# EAGLE schematic beagl (EAGLE 6.2)
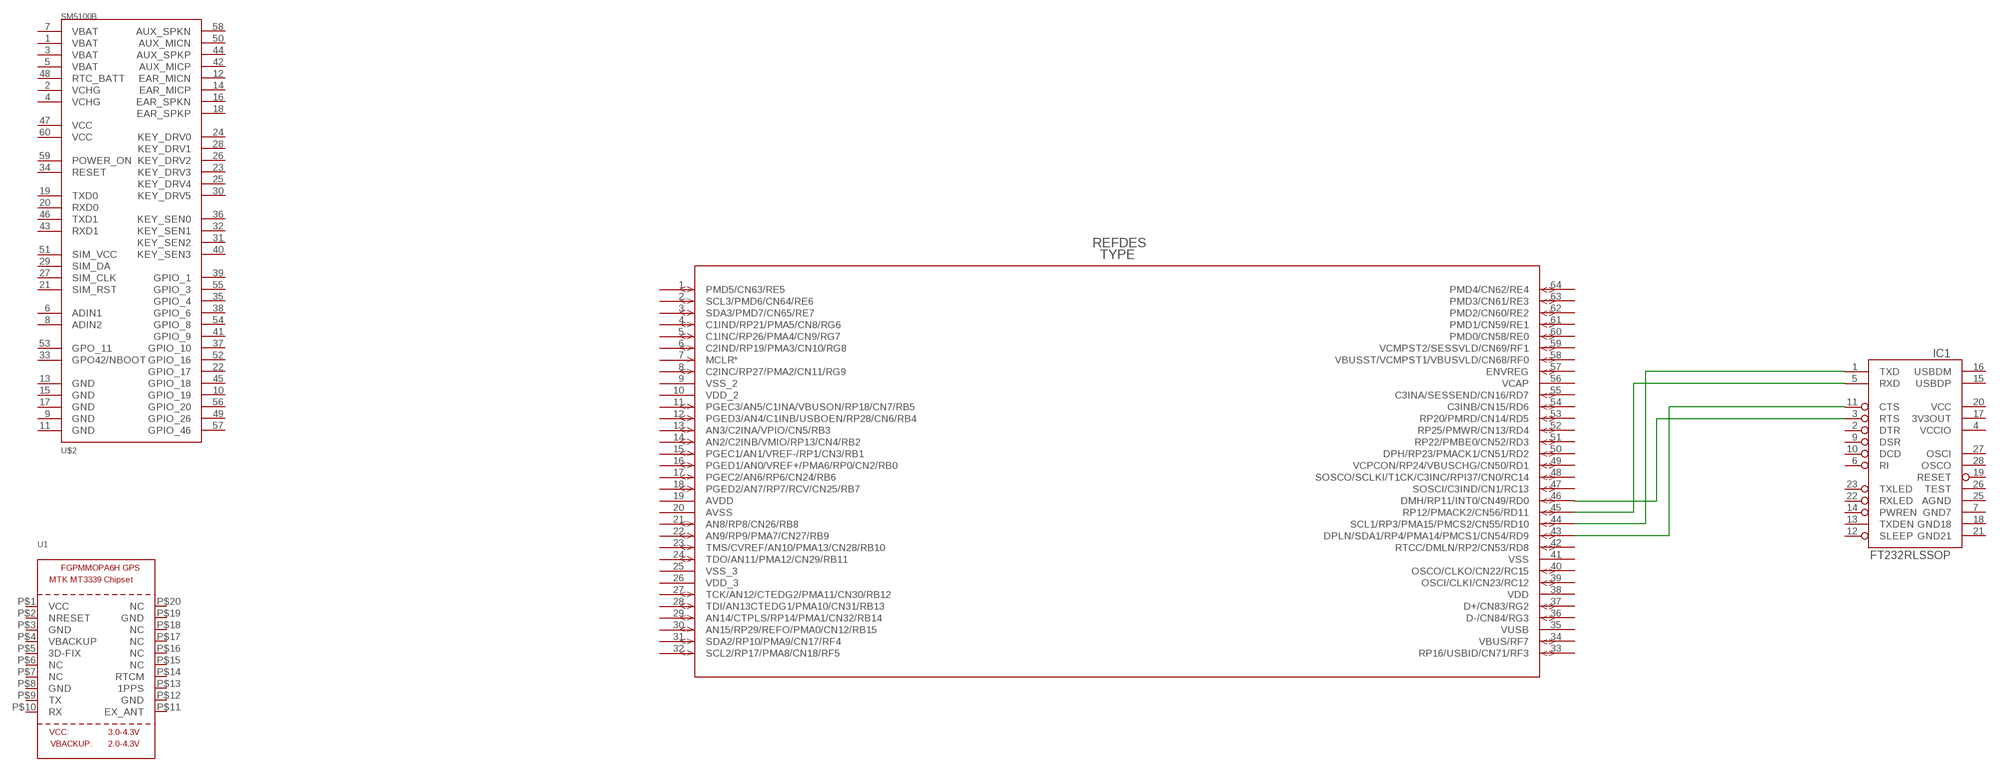
[diagram p0: schematic, sheet 1]

## Parts
IC1  FT232RLSSOP  [SSOP28DB]
U1  GPS_FGPMMOPA6H  [FGPMMOPA6H]
U$1  PIC24FJ256GB206-  [TQFP64_10X10MC]
U$2  SM5100B  [SM5100B]

## Nets
N$1: IC1.1(TXD) U$1.44(SCL1/RP3/PMA15/PMCS2/CN55/RD10)
N$2: IC1.5(RXD) U$1.45(RP12/PMACK2/CN56/RD11)
N$3: IC1.3(RTS) U$1.46(DMH/RP11/INT0/CN49/RD0)
N$4: IC1.11(CTS) U$1.43(DPLN/SDA1/RP4/PMA14/PMCS1/CN54/RD9)
Unconnected: IC1.2(DTR) IC1.6(RI) IC1.9(DSR) IC1.10(DCD) IC1.12(SLEEP) IC1.13(TXDEN) IC1.14(PWREN) IC1.15(USBDP) IC1.16(USBDM) IC1.17(3V3OUT) IC1.19(RESET) IC1.22(RXLED) IC1.23(TXLED) IC1.26(TEST) IC1.27(OSCI) IC1.28(OSCO) U1.P$1(VCC) U1.P$2(NRESET) U1.P$3(GND) U1.P$4(VBACKUP) U1.P$5(3D-FIX) U1.P$6(NC) U1.P$7(NC) U1.P$8(GND) U1.P$9(TX) U1.P$10(RX) U1.P$11(EX_ANT) U1.P$12(GND) U1.P$13(1PPS) U1.P$14(RTCM) U1.P$15(NC) U1.P$16(NC) U1.P$17(NC) U1.P$18(NC) U1.P$19(GND) U1.P$20(NC) U$1.1(PMD5/CN63/RE5) U$1.2(SCL3/PMD6/CN64/RE6) U$1.3(SDA3/PMD7/CN65/RE7) U$1.4(C1IND/RP21/PMA5/CN8/RG6) U$1.5(C1INC/RP26/PMA4/CN9/RG7) U$1.6(C2IND/RP19/PMA3/CN10/RG8) U$1.7(MCLR*) U$1.8(C2INC/RP27/PMA2/CN11/RG9) U$1.9(VSS_2) U$1.10(VDD_2) U$1.11(PGEC3/AN5/C1INA/VBUSON/RP18/CN7/RB5) U$1.12(PGED3/AN4/C1INB/USBOEN/RP28/CN6/RB4) U$1.13(AN3/C2INA/VPIO/CN5/RB3) U$1.14(AN2/C2INB/VMIO/RP13/CN4/RB2) U$1.15(PGEC1/AN1/VREF-/RP1/CN3/RB1) U$1.16(PGED1/AN0/VREF+/PMA6/RP0/CN2/RB0) U$1.17(PGEC2/AN6/RP6/CN24/RB6) U$1.18(PGED2/AN7/RP7/RCV/CN25/RB7) U$1.19(AVDD) U$1.20(AVSS) U$1.21(AN8/RP8/CN26/RB8) U$1.22(AN9/RP9/PMA7/CN27/RB9) U$1.23(TMS/CVREF/AN10/PMA13/CN28/RB10) U$1.24(TDO/AN11/PMA12/CN29/RB11) U$1.25(VSS_3) U$1.26(VDD_3) U$1.27(TCK/AN12/CTEDG2/PMA11/CN30/RB12) U$1.28(TDI/AN13CTEDG1/PMA10/CN31/RB13) U$1.29(AN14/CTPLS/RP14/PMA1/CN32/RB14) U$1.30(AN15/RP29/REFO/PMA0/CN12/RB15) U$1.31(SDA2/RP10/PMA9/CN17/RF4) U$1.32(SCL2/RP17/PMA8/CN18/RF5) U$1.33(RP16/USBID/CN71/RF3) U$1.34(VBUS/RF7) U$1.35(VUSB) U$1.36(D-/CN84/RG3) U$1.37(D+/CN83/RG2) U$1.38(VDD) U$1.39(OSCI/CLKI/CN23/RC12) U$1.40(OSCO/CLKO/CN22/RC15) U$1.41(VSS) U$1.42(RTCC/DMLN/RP2/CN53/RD8) U$1.47(SOSCI/C3IND/CN1/RC13) U$1.48(SOSCO/SCLKI/T1CK/C3INC/RPI37/CN0/RC14) U$1.49(VCPCON/RP24/VBUSCHG/CN50/RD1) U$1.50(DPH/RP23/PMACK1/CN51/RD2) U$1.51(RP22/PMBE0/CN52/RD3) U$1.52(RP25/PMWR/CN13/RD4) U$1.53(RP20/PMRD/CN14/RD5) U$1.54(C3INB/CN15/RD6) U$1.55(C3INA/SESSEND/CN16/RD7) U$1.56(VCAP) U$1.57(ENVREG) U$1.58(VBUSST/VCMPST1/VBUSVLD/CN68/RF0) U$1.59(VCMPST2/SESSVLD/CN69/RF1) U$1.60(PMD0/CN58/RE0) U$1.61(PMD1/CN59/RE1) U$1.62(PMD2/CN60/RE2) U$1.63(PMD3/CN61/RE3) U$1.64(PMD4/CN62/RE4) U$2.1(VBAT) U$2.2(VCHG) U$2.3(VBAT) U$2.4(VCHG) U$2.5(VBAT) U$2.6(ADIN1) U$2.7(VBAT) U$2.8(ADIN2) U$2.9(GND) U$2.10(GPIO_19) U$2.11(GND) U$2.12(EAR_MICN) U$2.13(GND) U$2.14(EAR_MICP) U$2.15(GND) U$2.16(EAR_SPKN) U$2.17(GND) U$2.18(EAR_SPKP) U$2.19(TXD0) U$2.20(RXD0) U$2.21(SIM_RST) U$2.22(GPIO_17) U$2.23(KEY_DRV3) U$2.24(KEY_DRV0) U$2.25(KEY_DRV4) U$2.26(KEY_DRV2) U$2.27(SIM_CLK) U$2.28(KEY_DRV1) U$2.29(SIM_DA) U$2.30(KEY_DRV5) U$2.31(KEY_SEN2) U$2.32(KEY_SEN1) U$2.33(GPO42/NBOOT) U$2.34(RESET) U$2.35(GPIO_4) U$2.36(KEY_SEN0) U$2.37(GPIO_10) U$2.38(GPIO_6) U$2.39(GPIO_1) U$2.40(KEY_SEN3) U$2.41(GPIO_9) U$2.42(AUX_MICP) U$2.43(RXD1) U$2.44(AUX_SPKP) U$2.45(GPIO_18) U$2.46(TXD1) U$2.47(VCC) U$2.48(RTC_BATT) U$2.49(GPIO_26) U$2.50(AUX_MICN) U$2.51(SIM_VCC) U$2.52(GPIO_16) U$2.53(GPO_11) U$2.54(GPIO_8) U$2.55(GPIO_3) U$2.56(GPIO_20) U$2.57(GPIO_46) U$2.58(AUX_SPKN) U$2.59(POWER_ON) U$2.60(VCC)

## Power pins joined to a net without a drawn wire
AGND: IC1.25(AGND)
GND7: IC1.7(GND7)
GND18: IC1.18(GND18)
GND21: IC1.21(GND21)
VCC: IC1.20(VCC)
VCCIO: IC1.4(VCCIO)

## Library data of the parts
IC1 = SparkFun:FT232RL: USB UART FT232RL 4th Generation USB UART (USB <-> Serial) Controller. Spark Fun Electronics SKU : COM-00650
U1 = adafruit:GPS_FGPMMOPA6H: GPS Module - MTK MT3339 Chipset, -165dBm sensitivity, 22 channels, 10Hz, auto-select external antenna options
U$1 = pic24fj256gb206_i_pt:PIC24FJ256GB206-
U$2 = SparkFun:SM5100B